# EAGLE design ugv_board (EAGLE 8.4.2)
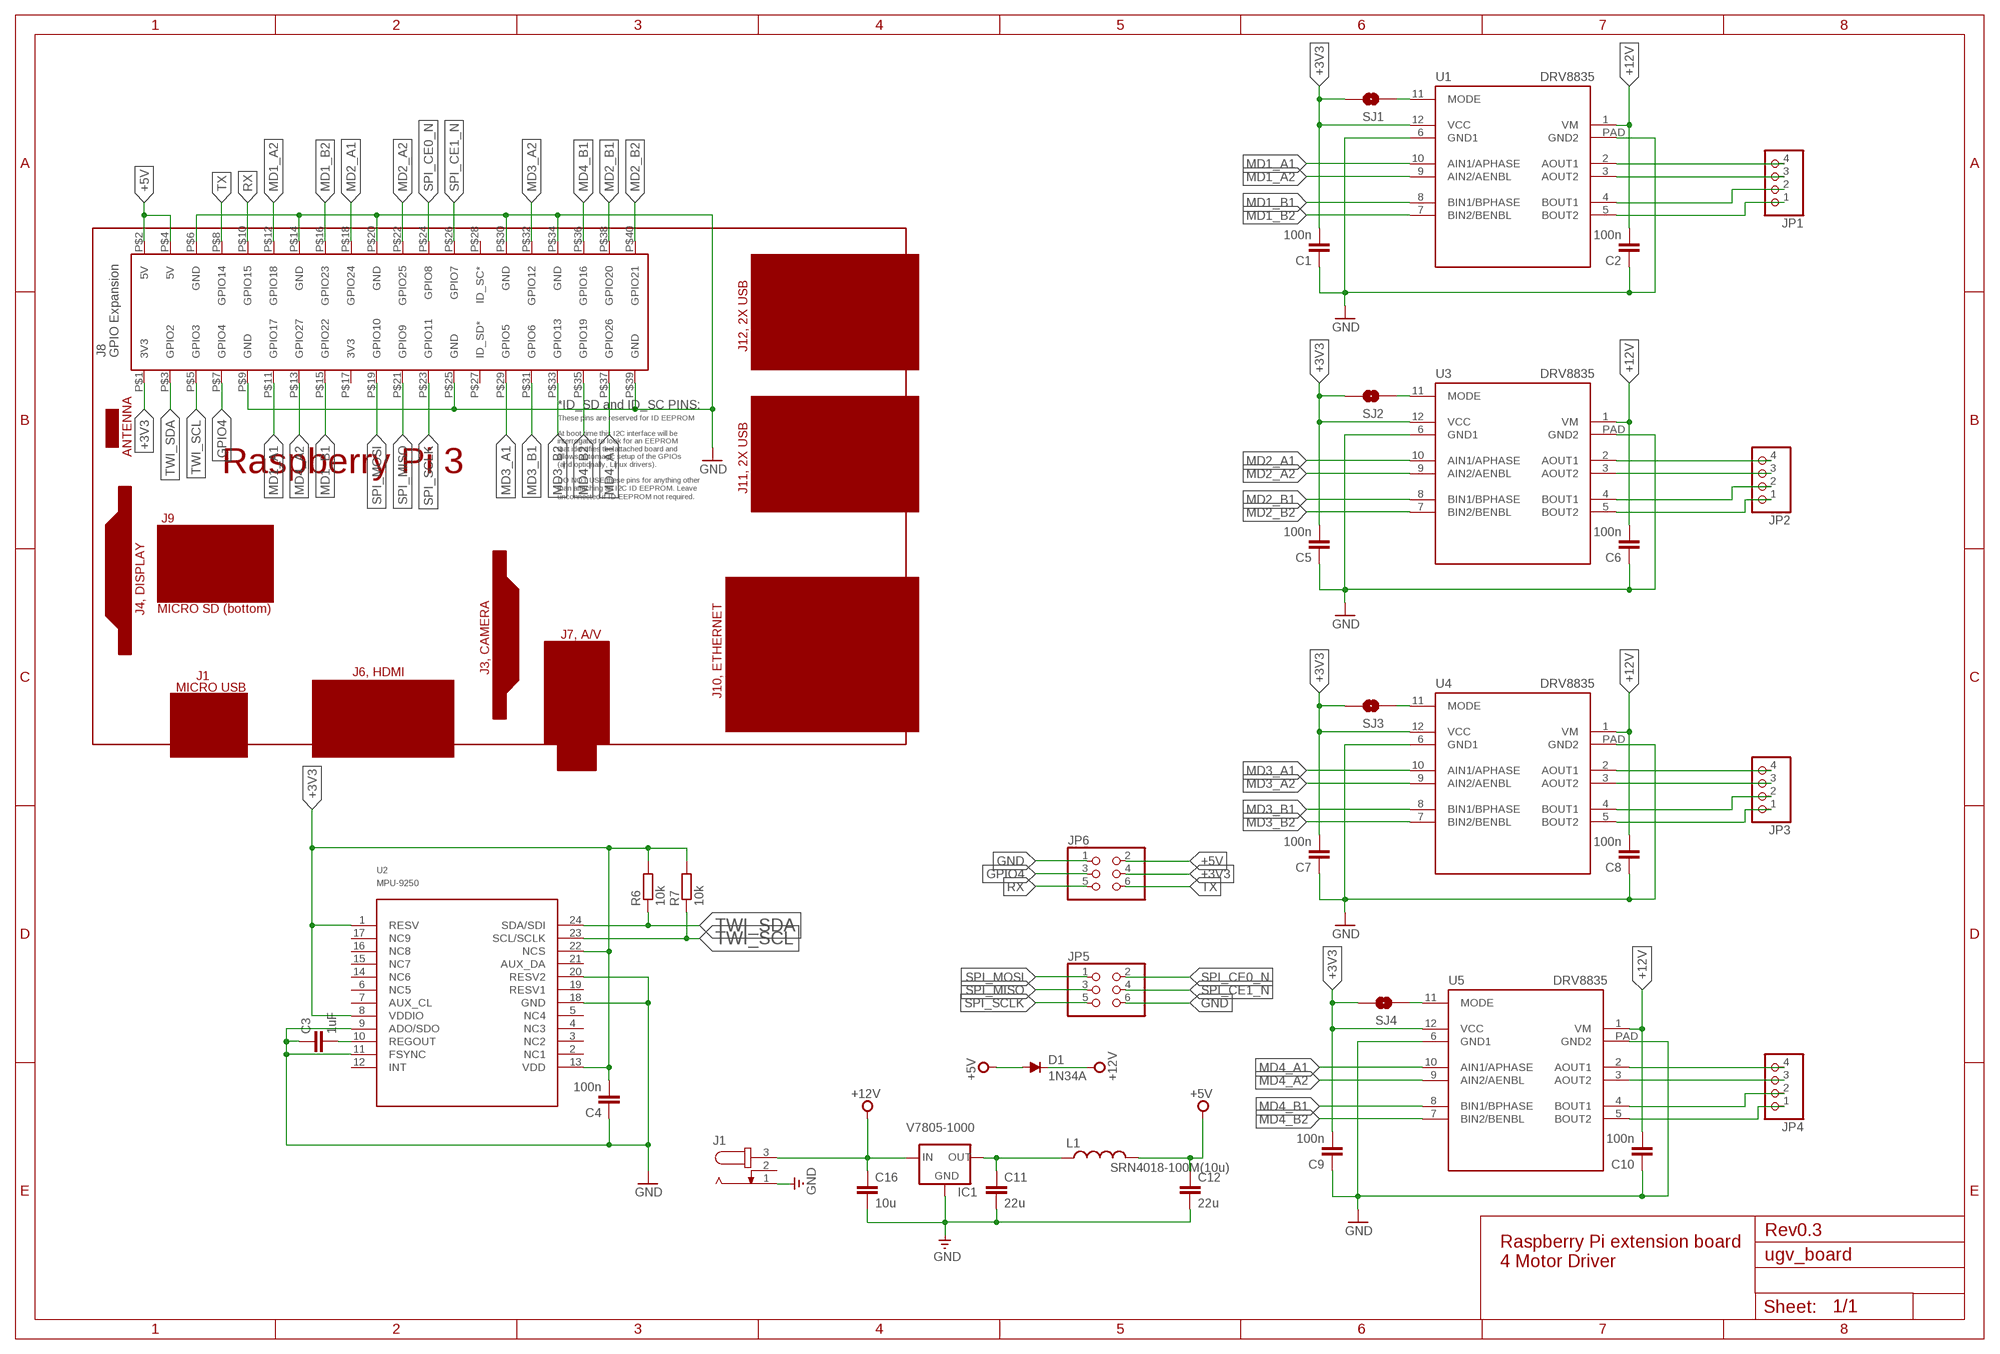
[diagram p0: schematic, sheet 1]

## Parts
C1  100n  C-EUC0402  [C0402]
C2  100n  C-EUC0402  [C0402]
C3  1uF  C-EUC0402  [C0402]
C4  100n  C-EUC0402  [C0402]
C5  100n  C-EUC0402  [C0402]
C6  100n  C-EUC0402  [C0402]
C7  100n  C-EUC0402  [C0402]
C8  100n  C-EUC0402  [C0402]
C9  100n  C-EUC0402  [C0402]
C10  100n  C-EUC0402  [C0402]
C11  22u  C-EUC0603  [C0603]
C12  22u  C-EUC0603  [C0603]
C16  10u  C-EUC0603  [C0603]
D1  1N34A  [DO07]
IC1  V7805-1000  VR_1OUTXX  [DIP_3PIN]
J1  JACK-PLUG0  [SPC4077]
JP1  PINHD-1X4M  [1X04M]
JP2  PINHD-1X4M  [1X04M]
JP3  PINHD-1X4M  [1X04M]
JP4  PINHD-1X4M  [1X04M]
JP5  PINHD-2X3  [2X03]
JP6  PINHD-2X3  [2X03]
L1  SRN4018-100M(10u)  BOURNS-SRN4018  [BOURNS-SRN4018]
PCB1  RPI3  [RPI3]
R6  10k  R-EU_R0402  [R0402]
R7  10k  R-EU_R0402  [R0402]
SJ1  SOLDERJUMPERNC  [SJ_2S]
SJ2  SOLDERJUMPERNC  [SJ_2S]
SJ3  SOLDERJUMPERNC  [SJ_2S]
SJ4  SOLDERJUMPERNC  [SJ_2S]
U1  DRV8835  [WSON_2X3]
U2  MPU-9250  [LEAD-QFN24]
U3  DRV8835  [WSON_2X3]
U4  DRV8835  [WSON_2X3]
U5  DRV8835  [WSON_2X3]

## Nets
+3V3: C1.2 C4.2 C5.2 C7.2 C9.2 JP6.4 PCB1.P$1(3V3) R6.2 R7.2 SJ1.2 SJ2.2 SJ3.2 SJ4.2 U1.12(VCC) U2.1(RESV) U2.8(VDDIO) U2.13(VDD) U2.22(NCS) U3.12(VCC) U4.12(VCC) U5.12(VCC)
+5V: C12.1 D1.A JP6.2 L1.P$1 PCB1.P$2(5V) PCB1.P$4(5V)
+12V [VCC]: C2.2 C6.2 C8.2 C10.2 C16.1 D1.C IC1.IN J1.3 U1.1(VM) U3.1(VM) U4.1(VM) U5.1(VM)
GND [GND]: C1.1 C2.1 C3.1 C4.1 C5.1 C6.1 C7.1 C8.1 C9.1 C10.1 C11.2 C12.2 C16.2 IC1.GND J1.1 JP5.6 JP6.1 PCB1.P$6(GND) PCB1.P$9(GND) PCB1.P$14(GND) PCB1.P$20(GND) PCB1.P$25(GND) PCB1.P$30(GND) PCB1.P$34(GND) PCB1.P$39(GND) U1.6(GND1) U1.PAD(GND2) U2.9(ADO/SDO) U2.11(FSYNC) U2.18(GND) U2.20(RESV2) U3.6(GND1) U3.PAD(GND2) U4.6(GND1) U4.PAD(GND2) U5.6(GND1) U5.PAD(GND2)
GPIO4: JP6.3 PCB1.P$7(GPIO4)
MD1_A1: PCB1.P$11(GPIO17) U1.10(AIN1/APHASE)
MD1_A2: PCB1.P$12(GPIO18) U1.9(AIN2/AENBL)
MD1_B1: PCB1.P$15(GPIO22) U1.8(BIN1/BPHASE)
MD1_B2: PCB1.P$16(GPIO23) U1.7(BIN2/BENBL)
MD2_A1: PCB1.P$18(GPIO24) U3.10(AIN1/APHASE)
MD2_A2: PCB1.P$22(GPIO25) U3.9(AIN2/AENBL)
MD2_B1: PCB1.P$38(GPIO20) U3.8(BIN1/BPHASE)
MD2_B2: PCB1.P$40(GPIO21) U3.7(BIN2/BENBL)
MD3_A1: PCB1.P$29(GPIO5) U4.10(AIN1/APHASE)
MD3_A2: PCB1.P$32(GPIO12) U4.9(AIN2/AENBL)
MD3_B1: PCB1.P$31(GPIO6) U4.8(BIN1/BPHASE)
MD3_B2: PCB1.P$33(GPIO13) U4.7(BIN2/BENBL)
MD4_A1: PCB1.P$37(GPIO26) U5.10(AIN1/APHASE)
MD4_A2: PCB1.P$13(GPIO27) U5.9(AIN2/AENBL)
MD4_B1: PCB1.P$36(GPIO16) U5.8(BIN1/BPHASE)
MD4_B2: PCB1.P$35(GPIO19) U5.7(BIN2/BENBL)
N$1: JP1.4 U1.2(AOUT1)
N$2: JP1.3 U1.3(AOUT2)
N$3: JP1.2 U1.4(BOUT1)
N$4: JP4.4 U5.2(AOUT1)
N$5: JP1.1 U1.5(BOUT2)
N$6: JP2.4 U3.2(AOUT1)
N$7: JP2.3 U3.3(AOUT2)
N$8: JP2.2 U3.4(BOUT1)
N$9: JP2.1 U3.5(BOUT2)
N$10: JP3.4 U4.2(AOUT1)
N$11: JP3.3 U4.3(AOUT2)
N$12: JP3.2 U4.4(BOUT1)
N$13: JP3.1 U4.5(BOUT2)
N$14: JP4.3 U5.3(AOUT2)
N$15: JP4.2 U5.4(BOUT1)
N$16: JP4.1 U5.5(BOUT2)
N$17: SJ4.1 U5.11(MODE)
N$18: SJ3.1 U4.11(MODE)
N$19: SJ2.1 U3.11(MODE)
N$20: SJ1.1 U1.11(MODE)
N$22 [VCC]: C11.1 IC1.OUT L1.P$2
REGOUT: C3.2 U2.10(REGOUT)
RX: JP6.5 PCB1.P$10(GPIO15)
SPI_CE0_N: JP5.2 PCB1.P$24(GPIO8)
SPI_CE1_N: JP5.4 PCB1.P$26(GPIO7)
SPI_MISO: JP5.3 PCB1.P$21(GPIO9)
SPI_MOSI: JP5.1 PCB1.P$19(GPIO10)
SPI_SCLK: JP5.5 PCB1.P$23(GPIO11)
TWI_SCL: PCB1.P$5(GPIO3) R7.1 U2.23(SCL/SCLK)
TWI_SDA: PCB1.P$3(GPIO2) R6.1 U2.24(SDA/SDI)
TX: JP6.6 PCB1.P$8(GPIO14)
Unconnected: J1.2 PCB1.P$17(3V3) PCB1.P$27(ID_SD*) PCB1.P$28(ID_SC*) U2.2(NC1) U2.3(NC2) U2.4(NC3) U2.5(NC4) U2.6(NC5) U2.7(AUX_CL) U2.12(INT) U2.14(NC6) U2.15(NC7) U2.16(NC8) U2.17(NC9) U2.19(RESV1) U2.21(AUX_DA)

## Notes on the sheet
- Rev0.3
- Raspberry Pi extension board
  4 Motor Driver

## Library data of the parts
C1-C12 C16 = resistor:C-EU: CAPACITOR, European symbol
D1 = diode:1N34A: GERMANIUM DIODE
IC1 = openblw:VR_1OUT: VOLTAGE REGULATOR
J1 = con-jack:JACK-PLUG: DC POWER JACK Power Jack, DC, Right Angle, Through Hole, Rated 5A at 16VDC, PC Terminals Distributor: Farnell (www.Farnell.de) Drawing: 84N1161.pdf / 84N1162.pdf Manufacturer: SPC Technology (www.spctechnology.com) Type: SPC4077 / SPC 4078
JP1-JP4 = pinhead:PINHD-1X4: PIN HEADER
JP5 JP6 = pinhead+:PINHD-2X3: PIN HEADER
L1 = openblw:BOURNS-SRN4018
PCB1 = ugv_board:RPI3: Device for Raspberry Pi 3 board created by Dave Young for www.element14.com More information and support community is available at https://www.element14.com/community/community/raspberry-pi
R6 R7 = resistor:R-EU_: RESISTOR, European symbol
SJ1-SJ4 = SparkFun-Retired:SOLDERJUMPER: Solder Jumper Standard SMD solder jumper. Used to automate production. Two varients : Normally Open and Normally Closed are the same, but have different paste layers. NC will have a large amount of paste and should jumper during reflow.
U1 U3-U5 = bt_motordriver:DRV8835: DRV8835 DUAL LOW VOLTAGE H-BRIDGE IC The DRV8835 provides an integrated motor driver solution for cameras, consumer products, toys, and other low voltage or battery-powered motion control applications. The device has two H-bridge drivers, and can drive two DC motors or one stepper motor, as well as other devices like solenoids. The device has two H-bridge drivers, and drives two DC motors or one stepper motor, as well as other devices like solenoids. The output driver block for each consists of N-channel power MOSFETs configured as an H-bridge to drive the motor winding. An internal charge pump generates gate drive voltages. 1.5-A Maximum Drive Current Per H-Bridge Configure Bridges Parallel for 3-A Drive Curren 0-V to 11-V Motor-Operating Supply-Voltage 2-V to 7-V Logic Supply-Voltage Flexible PWM or PHASE/ENABLE Interface Low-Power Sleep Mode With 95-nA Maximum Supply Current Tiny 2.00-mm × 3.00-mm WSON Package Reference: http://www.ti.com/lit/ds/symlink/drv8835.pdf
U2 = invensense:MPU-9250

## Net classes
1 GND: width 0.508 mm, drill 0.3 mm, clearance 0.2 mm to class 0, clearance 0.2 mm
5 VCC: width 0.508 mm, drill 0.3 mm, clearance 0.3 mm to class 0, clearance 0.3 mm to class 1, clearance 0.5 mm to class 2, clearance 0.5 mm to class 3, clearance 0.5 mm to class 4, clearance 0.3 mm

## Board
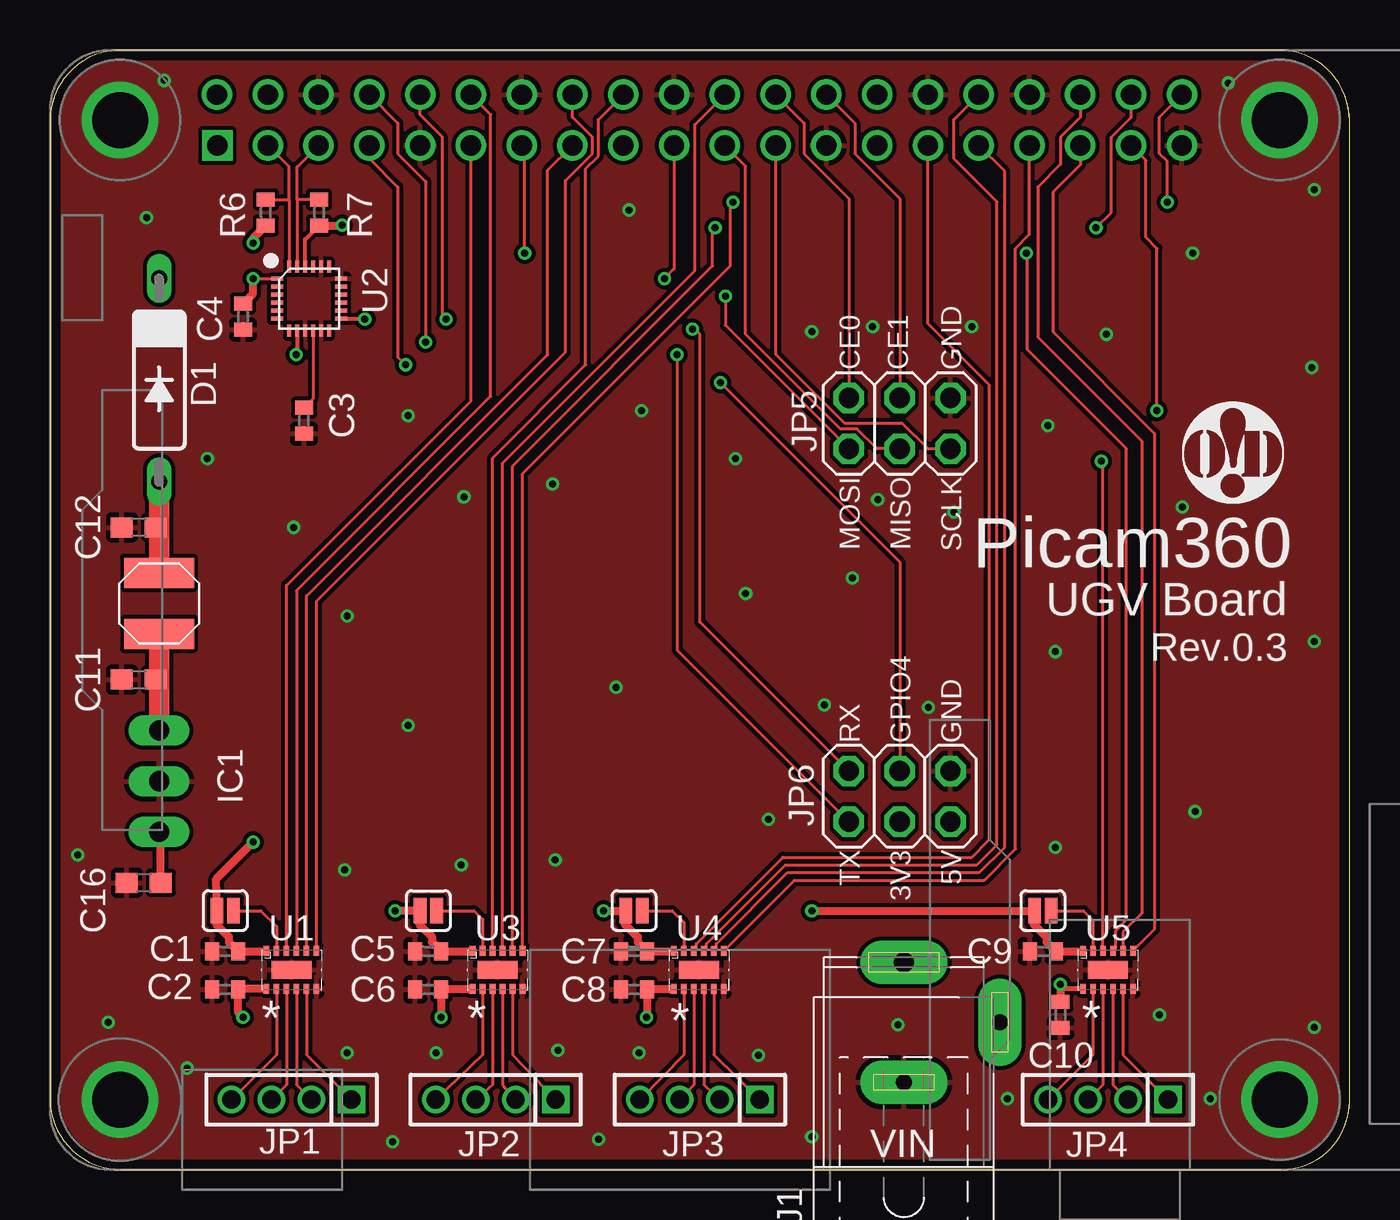
[diagram p1: board, top side]
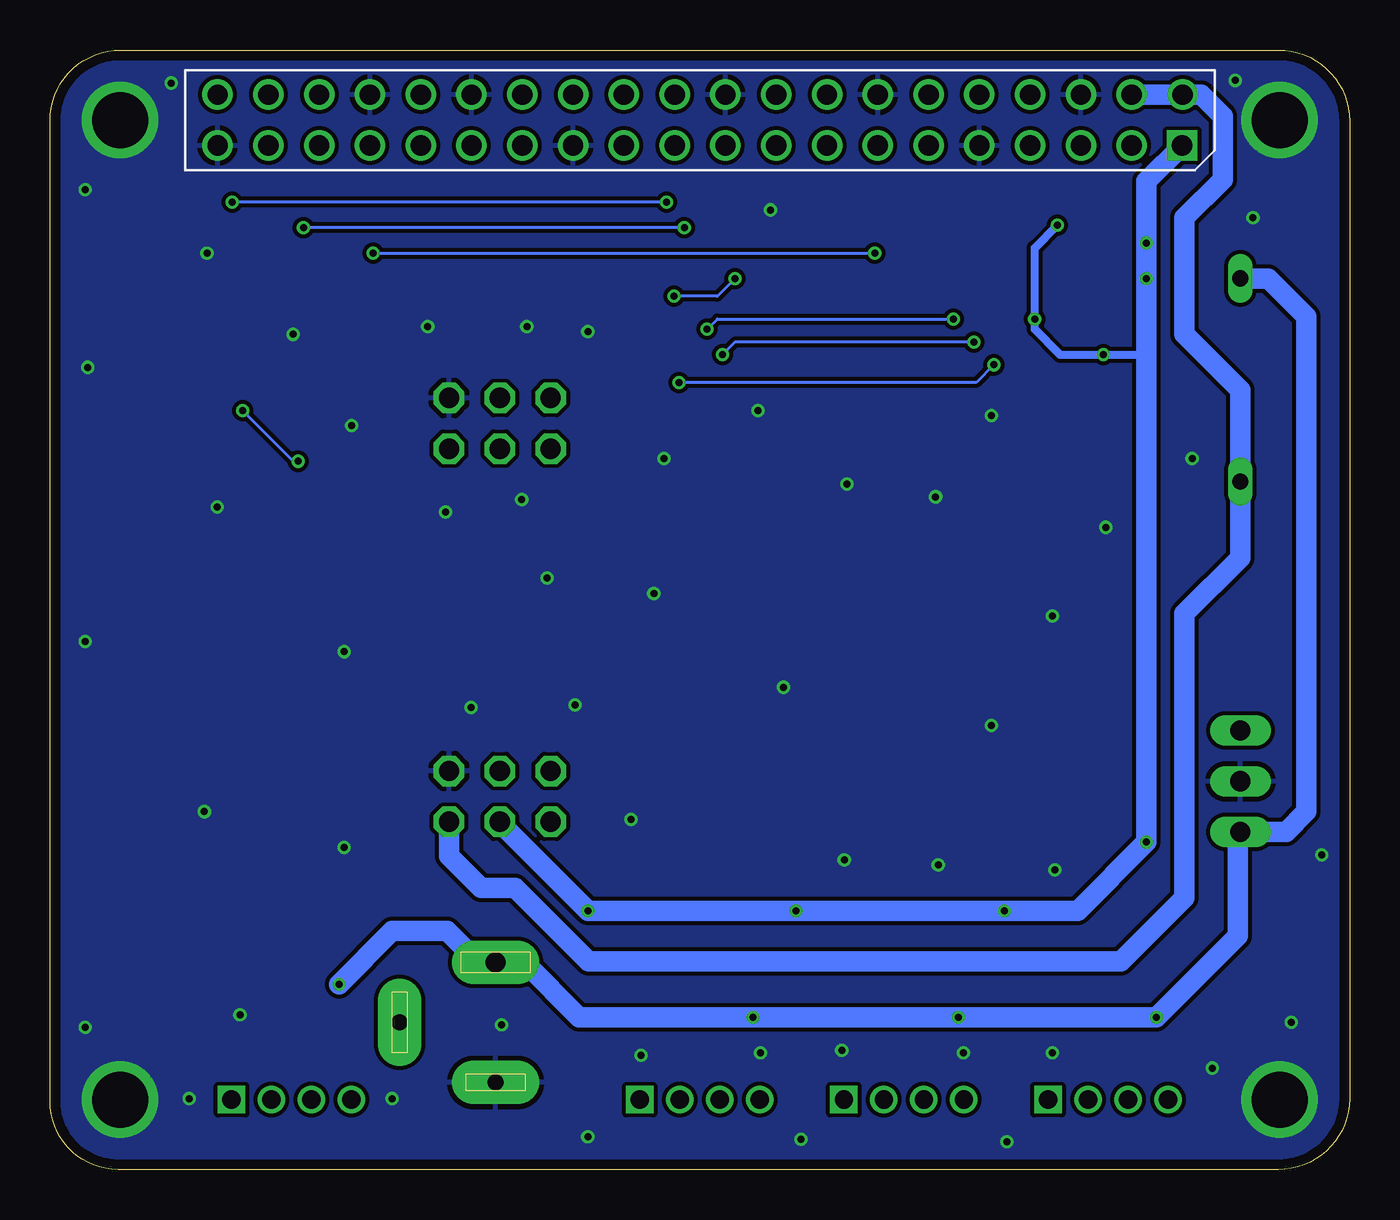
[diagram p2: board, bottom side, seen from below]

Size 65 x 56.01 mm. Coordinates in mm from the lower left corner, seen from the top.
Outline: 3.56,0 61.59,0 arc90 65,3.43 65,52.45 arc90 61.47,56.01 3.56,56.01 arc90 0,52.45 0,3.56 arc90 3.56,0
Copper layers (1*16): Top 0.035mm / dielectric 1.6mm / Bottom 0.035mm
Design rules "Elecrow_2-layer_PCB_eagle_rule": minimum track width 6mil, minimum drill 12mil, track to track 6mil, track to pad 6mil, pad to pad 6mil, via to via 8mil, smd to smd 0mil, copper to edge 20mil, drill to drill 10mil, minimum pad ring 6mil, minimum via ring 6mil, stop-mask expansion 0mil, vias tented up to drill 100mil, thermal gap 10mil

### Footprints (pad centres in the part's own frame; a part is rotated, then mirrored left to right if it is on the bottom)
C0402 = smd 0.7 x 0.9: 1 -0.65,0; 2 0.65,0
C0603 = smd 1.1 x 1: 1 -0.85,0; 2 0.85,0
DO07 = drill 0.813 long: A 5.08,0; C -5.08,0
DIP_3PIN = drill 1.016 long: GND 0,-2.54; IN -2.54,-2.54; OUT 2.54,-2.54
SPC4077 = drill 0.8 pad 2.184 long: 1 -3,0; 2 0,-4.8 | drill 1 pad 2.184 long: 3 3,0
1X04M = drill 0.914 square: 1 -3,0 | drill 0.914: 2 -1,0; 3 1,0; 4 3,0
2X03 = drill 1.016 octagon: 1 -2.54,-1.27; 2 -2.54,1.27; 3 0,-1.27; 4 0,1.27; 5 2.54,-1.27; 6 2.54,1.27
BOURNS-SRN4018 = smd 1.5 x 3.5: P$1 -1.525,0; P$2 1.525,0
RPI3 = drill 1.016 square: P$1 8.37,51.23 | drill 1.016: P$2 8.357,53.772; P$3 10.897,51.232; P$4 10.897,53.772; P$5 13.437,51.232; P$6 13.437,53.772; P$7 15.977,51.232; P$8 15.977,53.772; P$9 18.517,51.232; P$10 18.517,53.772; P$11 21.057,51.232; P$12 21.057,53.772; P$13 23.597,51.232; P$14 23.597,53.772; P$15 26.137,51.232; P$16 26.137,53.772; P$17 28.677,51.232; P$18 28.677,53.772; P$19 31.217,51.232; P$20 31.217,53.772; P$21 33.757,51.232; P$22 33.757,53.772; P$23 36.297,51.232; P$24 36.297,53.772; P$25 38.837,51.232; P$26 38.837,53.772; P$27 41.377,51.232; P$28 41.377,53.772; P$29 43.917,51.232; P$30 43.917,53.772; P$31 46.457,51.232; P$32 46.457,53.772; P$33 48.997,51.232; P$34 48.997,53.772; P$35 51.537,51.232; P$36 51.537,53.772; P$37 54.077,51.232; P$38 54.077,53.772; P$39 56.617,51.232; P$40 56.617,53.772
R0402 = smd 0.7 x 0.9: 1 -0.65,0; 2 0.65,0
SJ_2S = smd 0.635 x 1.27: 1 -0.412,0; 2 0.412,0
WSON_2X3 = smd 0.28 x 0.5: 1 -1.25,-0.95; 2 -0.75,-0.95; 3 -0.25,-0.95; 4 0.25,-0.95; 5 0.75,-0.95; 6 1.25,-0.95; 7 1.25,0.95; 8 0.75,0.95; 9 0.25,0.95; 10 -0.25,0.95; 11 -0.75,0.95; 12 -1.25,0.95 | smd 2 x 0.9: PAD 0,0
LEAD-QFN24 = smd 0.6 x 0.2: 1 -1.6,1; 2 -1.6,0.6; 3 -1.6,0.2; 4 -1.6,-0.2; 5 -1.6,-0.6; 6 -1.6,-1; 13 1.6,-1; 14 1.6,-0.6; 15 1.6,-0.2; 16 1.6,0.2; 17 1.6,0.6; 18 1.6,1 | smd 0.2 x 0.6: 7 -1,-1.6; 8 -0.6,-1.6; 9 -0.2,-1.6; 10 0.2,-1.6; 11 0.6,-1.6; 12 1,-1.6; 19 1,1.6; 20 0.6,1.6; 21 0.2,1.6; 22 -0.2,1.6; 23 -0.6,1.6; 24 -1,1.6

### Placement (x,y rotation side)
C1  8.76,10.92 0 top
C2  8.76,9.02 0 top
C3  12.7,37.47 90 top
C4  9.65,42.67 90 top
C5  18.92,10.92 0 top
C6  18.92,9.02 0 top
C7  29.21,10.92 0 top
C8  29.21,9.02 0 top
C9  49.66,10.92 0 top
C10  50.55,7.75 90 top
C11  4.45,24.51 180 top
C12  4.45,32.13 180 top
C16  4.7,14.35 180 top
D1  5.46,39.5 270 top
IC1  2.92,19.43 90 top
J1  42.71,7.37 90 top
JP1  12.08,3.5 180 top
JP2  22.29,3.5 180 top
JP3  32.5,3.5 180 top
JP4  52.92,3.5 180 top
JP5  42.5,37.33 0 top
JP6  42.5,18.67 180 top
L1  5.46,28.32 270 top
PCB1  0,0 0 top
R6  10.79,47.88 270 top
R7  13.46,47.88 270 top
SJ1  8.76,12.95 180 top
SJ2  18.92,12.95 180 top
SJ3  29.21,12.95 180 top
SJ4  49.66,12.95 180 top
U1  12.08,10 0 top
U2  12.95,43.56 0 top
U3  22.39,10 0 top
U4  32.45,10 0 top
U5  52.92,10 0 top
U$1  [OHMYDIGIFAB_LOGO]  59.18,35.81 0 top

### Tracks (layer width: path | path; a pad name or v marks a point on that pad's centre or on a via)
+3V3  (via drill 0.35)
  Top 0.152: 10.19,44.56 U2.1 | 10.8,10.92 U1.12
  Top 0.203: U2.22 12.75,46.52 R7.2 | U2.13 15.73,42.56 v15.75,42.55 | U2.8 12.35,40.8 v12.32,40.77
  Top 0.406: v38.1,12.95 SJ4.2 49.21,12.28 49.84,11.65 49.84,11.39 C9.2 51.64,10.92 U5.12 | v27.69,12.95 SJ3.2 28.76,12.28 29.39,11.65 29.39,11.39 C7.2 31.17,10.92 U4.12 | U3.12 20.98,10.92 C5.2 19.11,11.39 19.11,11.65 18.47,12.28 SJ2.2 v17.27,12.95 | 10.8,10.92 C1.2 8.95,11.39 8.95,11.65 8.31,12.28 SJ1.2 8.31,14.54 v10.16,16.38 | 10.78,47.24 R6.2 10.16,46.59 v10.16,46.35 | v14.61,47.24 14.59,47.23 R7.2 | C4.2 10.16,43.83 v10.16,44.58
  Top 0.508: v10.16,44.58 10.18,44.56 10.19,44.56
  Bottom 0.406: 42.55,17.36 JP6.4 | v14.61,47.24 15.75,46.1 v15.75,42.55 15.75,42.04 14.48,40.77 v12.32,40.77 10.16,40.77
  Bottom 1.016: 8.51,51.09 PCB1.P$1 10.16,49.44 v10.16,46.35 v10.16,44.58 10.16,40.77 v10.16,16.38 13.59,12.95 v17.27,12.95 v27.69,12.95 v38.1,12.95 42.5,17.35 JP6.4
+5V
  Top 0.203: C12.1 5.29,30.14 L1.P$1
  Top 1.016: L1.P$1 D1.A
  Bottom 1.016: PCB1.P$4 PCB1.P$2 7.42,53.77 6.35,52.7 6.35,49.53 8.26,47.62 8.26,41.78 5.46,38.99 D1.A 5.46,30.61 8.26,27.81 8.26,13.59 11.43,10.41 38.05,10.41 41.74,14.1 43.43,14.1 45.04,15.7 JP6.2
+12V  (via drill 0.35)
  Top 0.152: 31.06,9.02 31.17,9.02 U4.1 | 21,9.02 21.11,9.02 U3.1
  Top 0.254: U5.1 50.77,9.05 v50.55,9.27 | U1.1 10.69,9.05
  Top 0.406: 31.06,9.02 C8.2 29.86,7.63 v29.84,7.62 | 21,9.02 C6.2 19.57,7.63 v19.56,7.62 | v9.65,7.62 9.41,7.86 C2.2 9.45,9.05 10.69,9.05 | C16.1 5.55,16.8 IC1.IN | v50.55,9.27 C10.2
  Bottom 1.016: D1.C 4.06,44.58 2.16,42.67 2.16,17.91 3.17,16.89 IC1.IN 5.59,16.76 5.59,11.68 v9.65,7.62 v19.56,7.62 v29.84,7.62 38.53,7.62 41.27,10.37 J1.3 43.56,10.37 45.13,11.94 47.88,11.94 v50.55,9.27
GND  (via drill 0.35, 2.8)
  other vias: 14.86,27.69 20.7,33.66 14.73,14.99 20.57,15.24 17.91,22.23 25.15,34.29 29.59,37.97 25.27,15.49 35.94,17.53 28.32,24.13 34.29,35.56 34.8,28.83 40.13,29.59 38.73,23.24 43.94,23.11 41.4,33.53 45.21,32.89 49.91,37.21 50.29,16.13 50.29,25.91 17.91,37.72 12.19,32.13 7.87,35.56 4.83,47.62 1.4,15.75 2.92,7.37 6.86,5.08 14.86,5.84 19.3,5.84 25.4,5.97 29.46,5.84 35.43,5.71 42.42,7.24 47.88,3.56 58.04,3.56 63.25,7.11 55.5,7.75 57.28,17.91 63.25,26.42 56.64,33.15 63.12,40.13 57.15,45.85 63.25,49.02 5.71,54.48 58.93,54.36 28.96,48.01 38.1,41.91 41.15,42.16 46.1,42.16 52.83,41.78 17.14,1.4 27.43,1.52 38.1,1.65 3.5,52.5 61.5,52.5 61.5,3.5 3.5,3.5
  pour Top: 0,0 65,0 65,56 0,56
  pour Bottom: 0,0 65.02,0 65.02,56.01 0,56.01
GPIO4  (via drill 0.35)
  Top 0.152: PCB1.P$7 15.98,50.57 17.4,49.15 17.4,40.64 v17.78,40.26 | v33.53,39.37 42.5,30.4 JP6.3
  Bottom 0.152: v17.78,40.26 18.67,39.37 v33.53,39.37
MD1_A1
  Top 0.152: U1.10 11.83,29.23 21.06,38.46 PCB1.P$11
MD1_A2
  Top 0.152: U1.9 12.33,28.97 22.05,38.68 22.05,52.78 PCB1.P$12
MD1_B1
  Top 0.152: U1.8 12.83,28.7 24.89,40.77 24.89,49.99 PCB1.P$15
MD1_B2
  Top 0.152: U1.7 13.33,28.44 25.78,40.89 25.78,49.48 27.13,50.82 27.13,51.64 26.14,52.63 PCB1.P$16
MD2_A1
  Top 0.152: U3.10 22.14,35.6 26.8,40.26 26.8,50.06 27.43,50.7 27.43,52.53 PCB1.P$18
MD2_A2
  Top 0.152: U3.9 22.64,35.34 32.26,44.96 32.26,52.27 PCB1.P$22
MD2_B1  (via drill 0.35)
  Top 0.152: U3.8 23.14,35.2 33.15,45.21 33.15,46.99 v33.27,47.12 | PCB1.P$38 54.08,52.63 53.09,51.64 53.09,47.88 v52.32,47.12
  Bottom 0.152: v33.27,47.12 v52.32,47.12
MD2_B2  (via drill 0.35)
  Top 0.152: U3.7 23.64,34.81 34.04,45.21 34.04,48.26 v34.16,48.39 | v55.88,48.39 55.88,50.44 55.5,50.82 55.5,52.65 PCB1.P$40
  Bottom 0.152: v34.16,48.39 v55.88,48.39
MD3_A1
  Top 0.152: U4.10 32.33,11.08 32.33,11.29 36.66,15.62 46.1,15.62 46.99,16.51 46.99,39.24 43.92,42.32 PCB1.P$29
MD3_A2
  Top 0.152: U4.9 32.83,11.08 32.83,11.29 36.78,15.24 46.35,15.24 47.37,16.26 47.37,48.41 45.21,50.57 45.21,52.53 PCB1.P$32
MD3_B1
  Top 0.152: U4.8 33.33,11.08 33.33,11.29 36.9,14.86 46.48,14.86 47.75,16.13 47.75,49.94 PCB1.P$31
MD3_B2
  Top 0.152: U4.7 37.23,14.48 46.74,14.48 48.29,16.03 48.29,46.08 49,46.78 PCB1.P$33
MD4_A1  (via drill 0.35)
  Top 0.152: U5.10 52.67,35.34 v52.58,35.43 | v55.37,37.97 55.37,46.08 54.82,46.63 54.82,50.49 PCB1.P$37
  Bottom 0.152: v52.58,35.43 52.83,35.43 v55.37,37.97
MD4_A2  (via drill 0.35)
  Top 0.152: U5.9 53.3,11.08 53.3,11.95 53.85,12.5 53.85,36.07 48.9,41.02 48.9,45.85 v48.85,45.85 | v23.75,45.85 23.75,51.08 PCB1.P$13
  Bottom 0.152: v48.85,45.85 v23.75,45.85
MD4_B1
  Top 0.152: PCB1.P$36 51.54,52.63 50.55,51.64 50.55,50.29 49.4,49.15 49.4,41.66 54.61,36.45 54.61,12.83 53.67,11.89 U5.8
MD4_B2
  Top 0.152: PCB1.P$35 51.54,50.27 50.16,48.9 50.16,41.91 55.24,36.83 55.24,12.03 U5.7
N$1
  Top 0.152: U1.2 11.33,5.75 JP1.4
N$2
  Top 0.152: U1.3 11.83,4.25 JP1.3
N$3
  Top 0.152: U1.4 12.33,4.25 JP1.2
N$4
  Top 0.152: U5.2 52.17,5.75 JP4.4
N$5
  Top 0.152: U1.5 12.83,5.75 JP1.1
N$6
  Top 0.152: U3.2 21.64,5.75 JP2.4
N$7
  Top 0.152: U3.3 22.14,4.25 JP2.3
N$8
  Top 0.152: U3.4 22.64,4.25 JP2.2
N$9
  Top 0.152: U3.5 23.14,5.75 JP2.1
N$10
  Top 0.152: U4.2 31.7,5.75 JP3.4
N$11
  Top 0.152: U4.3 32.2,4.25 JP3.3
N$12
  Top 0.152: U4.4 32.7,4.25 JP3.2
N$13
  Top 0.152: U4.5 33.2,5.75 JP3.1
N$14
  Top 0.152: U5.3 52.67,4.25 JP4.3
N$15
  Top 0.152: U5.4 53.17,4.25 JP4.2
N$16
  Top 0.152: U5.5 53.67,5.75 JP4.1
N$17
  Top 0.152: SJ4.1 51.69,12.95 52.17,12.47 U5.11
N$18
  Top 0.152: SJ3.1 31.11,12.95 31.7,12.37 U4.11
N$19
  Top 0.152: SJ2.1 21.21,12.95 21.64,12.53 U3.11
N$20
  Top 0.152: SJ1.1 10.54,12.95 11.33,12.16 U1.11
N$22
  Top 0.203: C11.1 5.46,24.55 5.46,26.67
  Top 1.016: IC1.OUT 5.46,26.67 L1.P$2
REGOUT
  Top 0.152: U2.10 13.15,38.57 C3.2
RX  (via drill 0.35)
  Top 0.152: JP6.5 32.51,27.39 32.51,41.78 32.26,42.04 v32.13,42.04 | PCB1.P$10 18.52,52.76 19.63,51.64 19.63,42.72 v19.81,42.55
  Bottom 0.152: v32.13,42.04 31.62,42.55 v19.81,42.55
SPI_CE0_N
  Top 0.152: PCB1.P$24 37.72,52.35 37.72,50.82 39.96,48.58 JP5.2
SPI_CE1_N
  Top 0.152: PCB1.P$26 40.26,52.35 40.26,50.82 42.5,48.58 JP5.4
SPI_MISO
  Top 0.152: JP5.3 41.36,36.06 40.37,37.05 39.53,37.05 34.8,41.78 34.8,50.19 PCB1.P$21
SPI_MOSI  (via drill 0.35)
  Top 0.152: PCB1.P$19 31.22,45.06 v30.73,44.58 | v33.78,43.69 33.78,42.24 JP5.1
  Bottom 0.152: v30.73,44.58 31.62,43.69 v33.78,43.69
SPI_SCLK
  Top 0.152: PCB1.P$23 36.3,40.79 39.73,37.35 42.61,37.35 43.9,36.06 JP5.5
TWI_SCL
  Top 0.152: PCB1.P$5 12.35,50.15 12.35,48.51 | 12.35,48.51 U2.23 | R7.1 12.37,48.53 12.35,48.51
TWI_SDA
  Top 0.152: PCB1.P$3 11.95,50.17 11.95,48.51 | 11.95,48.51 U2.24 | R6.1 11.94,48.53 11.95,48.51
TX  (via drill 0.35)
  Top 0.152: PCB1.P$8 17.4,52.35 17.4,50.82 18.8,49.42 v18.8,41.4 | v31.37,40.77 31.37,25.99 JP6.6
  Bottom 0.152: v18.8,41.4 30.73,41.4 v31.37,40.77

### Text on the board
tPlace: Picam360 | UGV Board | Rev.0.3 | * | * | * | *
tNames: CE0 | CE1 | GND | MOSI | MISO | SCLK | RX | GPIO4 | GND | TX | 3V3 | 5V | VIN